# EAGLE design SDW BLUEPILL (EAGLE 9.6.2)
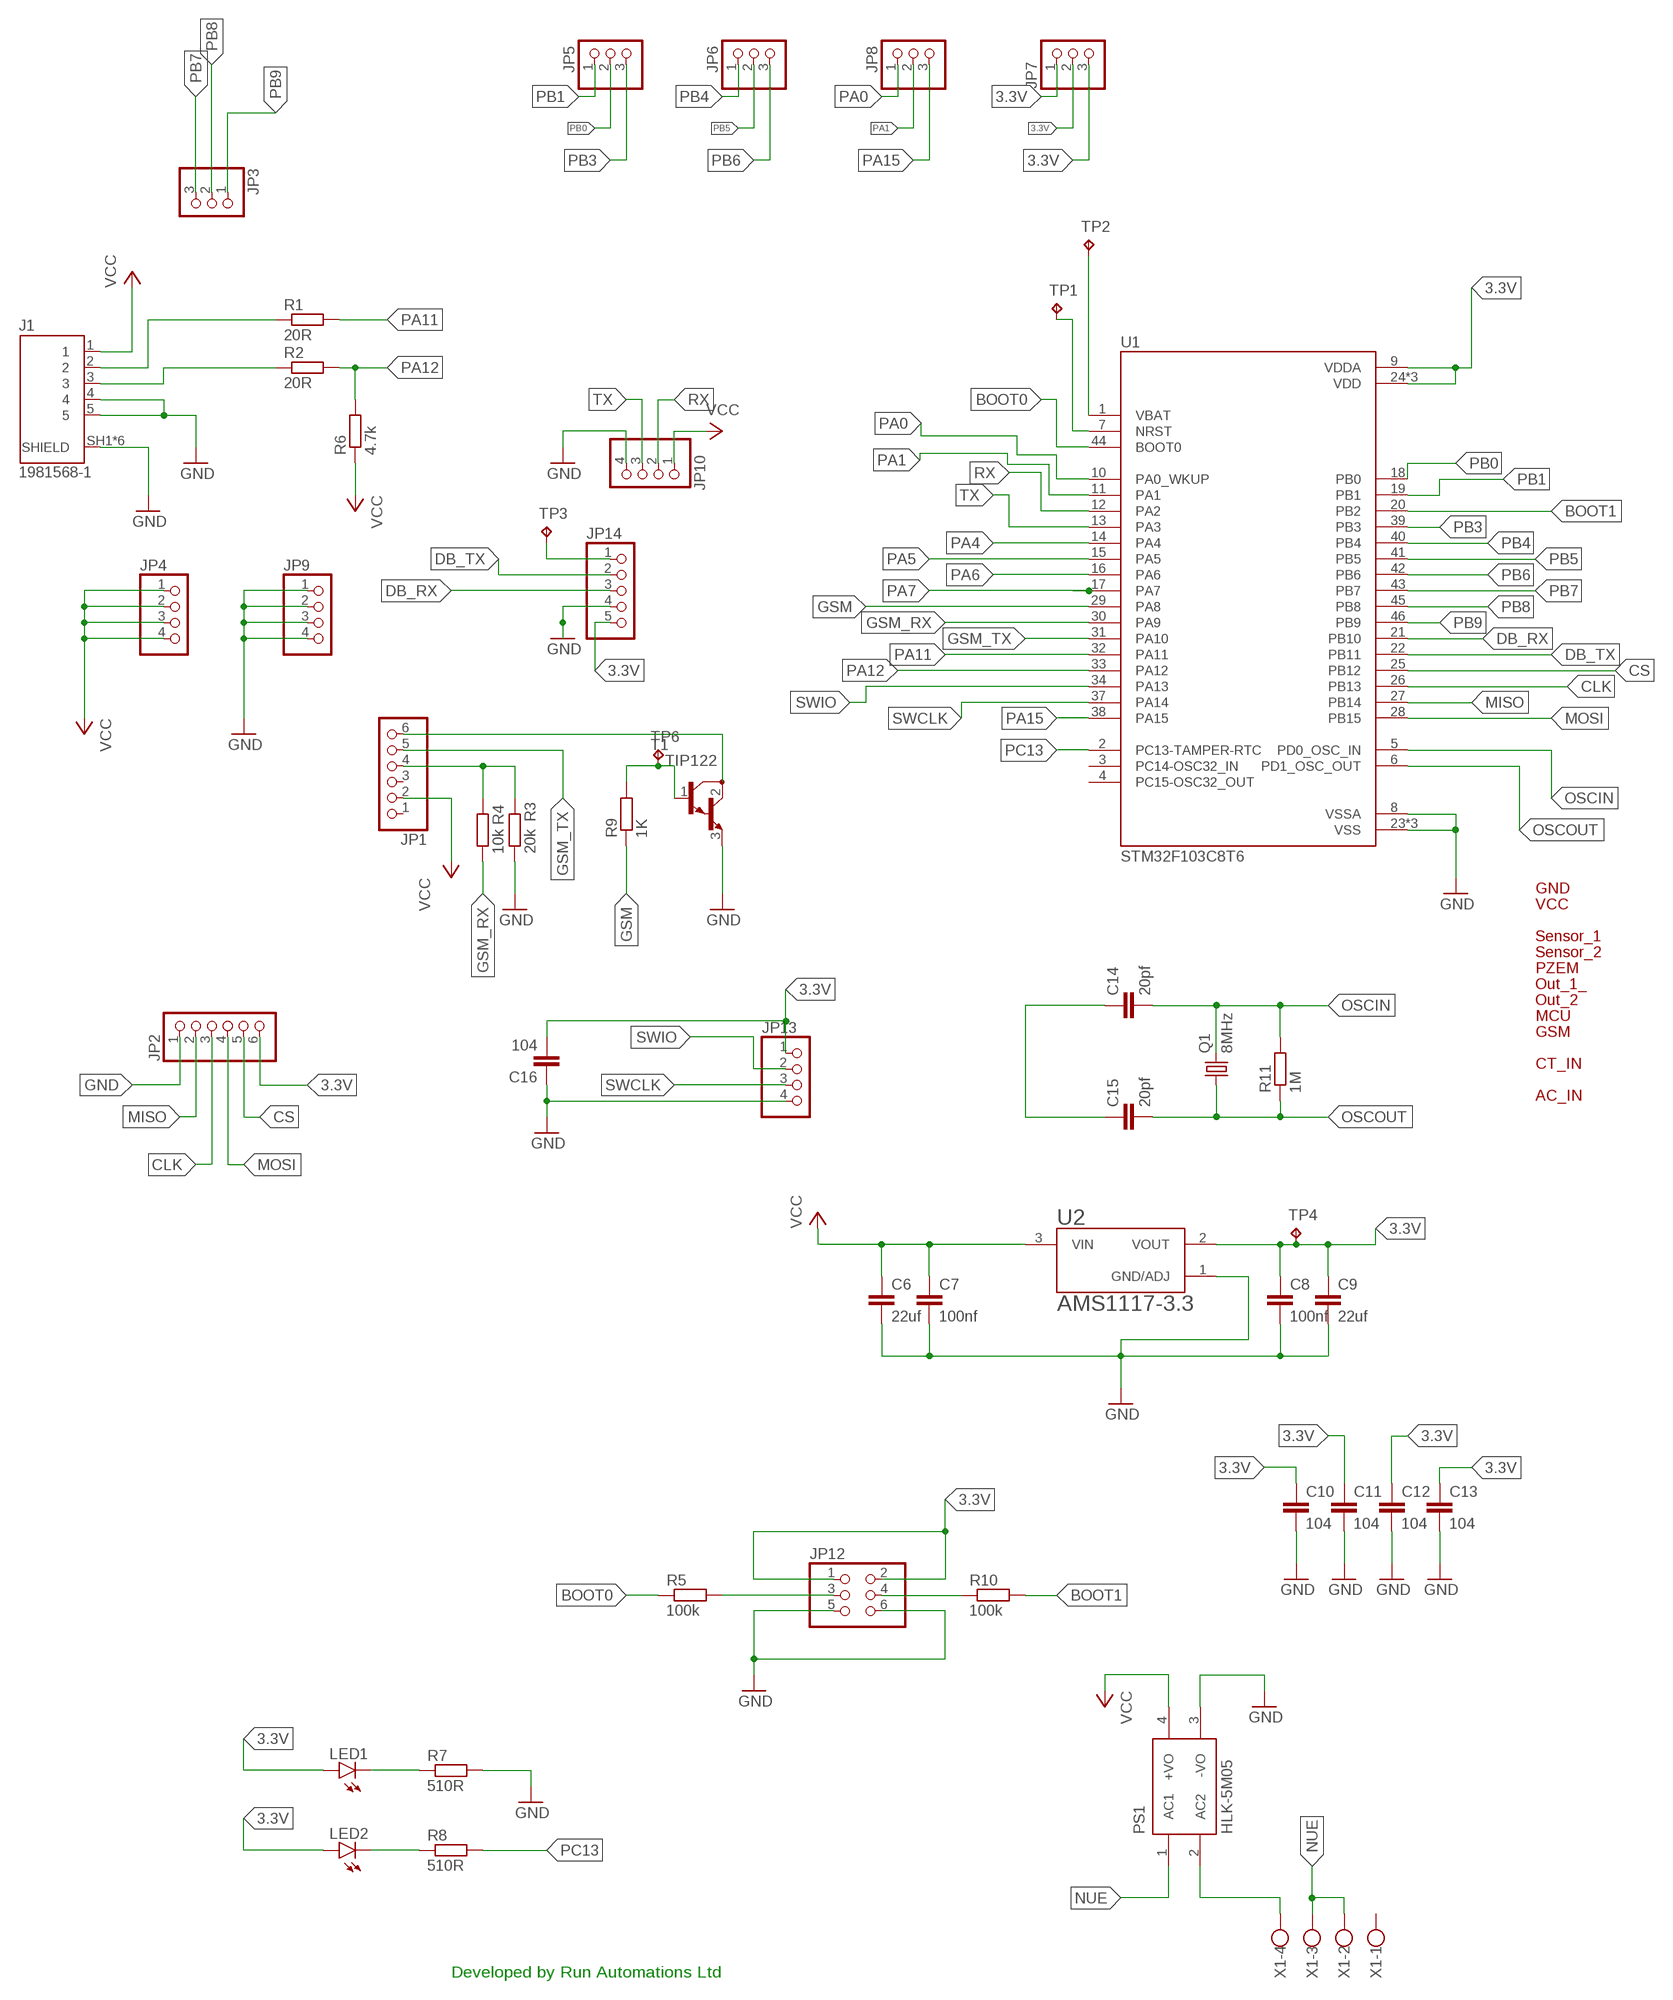
[diagram p0: schematic, sheet 1]

## Parts
C6  22uf  C-EUC0805  [C0805]
C7  100nf  C-EUC0805  [C0805]
C8  100nf  C-EUC0805  [C0805]
C9  22uf  C-EUC0805  [C0805]
C10  104  C-EUC0805  [C0805]
C11  104  C-EUC0805  [C0805]
C12  104  C-EUC0805  [C0805]
C13  104  C-EUC0805  [C0805]
C14  20pf  C-EUC0805  [C0805]
C15  20pf  C-EUC0805  [C0805]
C16  104  C-EUC0805  [C0805]
J1  1981568-1  [TE_1981568-1]
JP1  PINHD-1X6  [1X06]
JP2  PINHD-1X6  [1X06]
JP3  PINHD-1X3  [1X03]
JP4  PINHD-1X4  [1X04]
JP5  PINHD-1X3  [1X03]
JP6  PINHD-1X3  [1X03]
JP7  PINHD-1X3  [1X03]
JP8  PINHD-1X3  [1X03]
JP9  PINHD-1X4  [1X04]
JP10  PINHD-1X4  [1X04]
JP12  PINHD-2X3  [2X03]
JP13  PINHD-1X4/90  [1X04/90]
JP14  PINHD-1X5  [1X05]
LED1  LEDCHIPLED_0805  [CHIPLED_0805]
LED2  LEDCHIPLED_0805  [CHIPLED_0805]
PS1  HLK-5M05  [CONV_HLK-5M05]
Q1  8MHz  CRYSTALHC49S  [HC49/S]
R1  20R  R-EU_M0805  [M0805]
R2  20R  R-EU_M0805  [M0805]
R3  20k  R-EU_M0805  [M0805]
R4  10k  R-EU_M0805  [M0805]
R5  100k  R-EU_M0805  [M0805]
R6  4.7k  R-EU_M0805  [M0805]
R7  510R  R-EU_M0805  [M0805]
R8  510R  R-EU_M0805  [M0805]
R9  1K  R-EU_M0805  [M0805]
R10  100k  R-EU_M0805  [M0805]
R11  1M  R-EU_M0805  [M0805]
T1  TIP122  [TO220]
TP1  TPB1,27  [B1,27]
TP2  TPB1,27  [B1,27]
TP3  TPB1,27  [B1,27]
TP4  TPB1,27  [B1,27]
TP6  TPB1,27  [B1,27]
U1  STM32F103C8T6  [QFP50P900X900X160-48N]
U2  AMS1117-3.3  [SOT229P700X180-4N]
U$2  VCC0  [VCC0]
U$3  GND0  [GND0]
U$5  SENSOR_10  [SENSOR_10]
U$6  SENSOR_20  [SENSOR_20]
U$7  PZEM0  [PZEM0]
U$8  OUT_1_0  [OUT_1_0]
U$9  OUT_20  [OUT_20]
U$10  MCU0  [MCU0]
U$11  GSM0  [GSM0]
U$13  CT_IN0  [CT_IN0]
U$15  AC_IN0  [AC_IN0]
X1  W237-4  [W237-4]

## Nets
3.3V: C8.1 C9.1 C10.1 C11.1 C12.1 C13.1 C16.2 JP2.6 JP7.1 JP7.2 JP7.3 JP12.1 JP12.2 JP13.1 JP14.5 LED1.A LED2.A TP4.TP U1.9(VDDA) U1.24(VDD) U1.36(VDD) U1.48(VDD) U2.2(VOUT)
BOOT0: R5.1 U1.44(BOOT0)
BOOT1: R10.2 U1.20(PB2)
CLK: JP2.3 U1.26(PB13)
CS: JP2.5 U1.25(PB12)
DB_RX: JP14.3 U1.21(PB10)
DB_TX: JP14.2 U1.22(PB11)
GND: C6.2 C7.2 C8.2 C9.2 C10.2 C11.2 C12.2 C13.2 C16.1 J1.4 J1.5 J1.SH1(SHIELD) J1.SH2(SHIELD) J1.SH3(SHIELD) J1.SH4(SHIELD) J1.SH5(SHIELD) J1.SH6(SHIELD) JP2.1 JP9.1 JP9.2 JP9.3 JP9.4 JP10.4 JP12.5 JP12.6 JP13.4 JP14.4 PS1.3(-VO) R3.1 R7.2 T1.3(E) U1.8(VSSA) U1.23(VSS) U1.35(VSS) U1.47(VSS) U2.1(GND/ADJ)
GSM: R9.1 U1.29(PA8)
GSM_RX: R4.1 U1.30(PA9)
GSM_TX: JP1.5 U1.31(PA10)
MISO: JP2.2 U1.27(PB14)
MOSI: JP2.4 U1.28(PB15)
N$1: PS1.2(AC2) X1.4
N$2: J1.2 R1.1
N$3: JP1.6 T1.2(C)
N$4: JP1.4 R3.2 R4.2
N$5: R9.2 T1.1(B) TP6.TP
N$6: LED1.C R7.1
N$8: J1.3 R2.1
N$9: LED2.C R8.1
N$10: JP12.3 R5.2
N$11: JP12.4 R10.1
N$16: C14.1 C15.1
N$18: TP2.TP U1.1(VBAT)
N$19: TP1.TP U1.7(NRST)
N$20: JP14.1 TP3.TP
NUE: PS1.1(AC1) X1.2 X1.3
OSCIN: C14.2 Q1.2 R11.2 U1.5(PD0_OSC_IN)
OSCOUT: C15.2 Q1.1 R11.1 U1.6(PD1_OSC_OUT)
PA0: JP8.1 U1.10(PA0_WKUP)
PA1: JP8.2 U1.11(PA1)
PA4: U1.14(PA4)
PA5: U1.15(PA5)
PA6: U1.16(PA6)
PA7: U1.17(PA7)
PA11: R1.2 U1.32(PA11)
PA12: R2.2 R6.2 U1.33(PA12)
PA15: JP8.3 U1.38(PA15)
PB0: JP5.2 U1.18(PB0)
PB1: JP5.1 U1.19(PB1)
PB3: JP5.3 U1.39(PB3)
PB4: JP6.1 U1.40(PB4)
PB5: JP6.2 U1.41(PB5)
PB6: JP6.3 U1.42(PB6)
PB7: JP3.3 U1.43(PB7)
PB8: JP3.2 U1.45(PB8)
PB9: JP3.1 U1.46(PB9)
PC13: R8.2 U1.2(PC13-TAMPER-RTC)
RX: JP10.2 U1.12(PA2)
SWCLK: JP13.3 U1.37(PA14)
SWIO: JP13.2 U1.34(PA13)
TX: JP10.3 U1.13(PA3)
VCC: C6.1 C7.1 J1.1 JP1.2 JP4.1 JP4.2 JP4.3 JP4.4 JP10.1 PS1.4(+VO) R6.1 U2.3(VIN)
Unconnected: JP1.1 JP1.3 U1.3(PC14-OSC32_IN) U1.4(PC15-OSC32_OUT) X1.1

## Notes on the sheet
- Developed by Run Automations Ltd

## Library data of the parts
C6-C16 = rcl:C-EU: CAPACITOR, European symbol; SPICEPREFIX: C
J1 = 1981568-1:1981568-1: Check availability <https://pricing.snapeda.com/parts/1981568-1/TE%20Connectivity/view-part?ref=eda>; AVAILABILITY: In Stock; CHECK_PRICES: https://www.snapeda.com/parts/1981568-1/TE+Connectivity+AMP+Connectors/view-part/?ref=eda; COMMENT: 1981568-1; DESCRIPTION: MICRO USB, TYPE B,; MF: TE Connectivity; MP: 1981568-1; PACKAGE: None; PRICE: None; PURCHASE-URL: https://www.snapeda.com/api/url_track_click_mouser/?unipart_id=99860&manufacturer=TE Connectivity&part_name=1981568-1&search_term=usb micro; SNAPEDA_LINK: https://www.snapeda.com/parts/1981568-1/TE+Connectivity+AMP+Connectors/view-part/?ref=snap
JP1 JP2 = pinhead:PINHD-1X6: PIN HEADER
JP3 JP5-JP8 = pinhead:PINHD-1X3: PIN HEADER
JP4 JP9 JP10 JP13 = pinhead:PINHD-1X4: PIN HEADER
JP12 = pinhead:PINHD-2X3: PIN HEADER
JP14 = pinhead:PINHD-1X5: PIN HEADER
LED1 LED2 = led:LED: LED OSRAM: - CHIPLED LG R971, LG N971, LY N971, LG Q971, LY Q971, LO R971, LY R971 LH N974, LH R974 LS Q976, LO Q976, LY Q976 LO Q996 - Hyper CHIPLED LW Q18S LB Q993, LB Q99A, LB R99A - SideLED LS A670, LO A670, LY A670, LG A670, LP A670 LB A673, LV A673, LT A673, LW A673 LH A674 LY A675 LS A676, LA A676, LO A676, LY A676, LW A676 LS A679, LY A679, LG A679 - Hyper Micro SIDELED® LS Y876, LA Y876, LO Y876, LY Y876 LT Y87S - SmartLED LW L88C, LW L88S LB L89C, LB L89S, LG L890 LS L89K, LO L89K, LY L89K LS L896, LA L896, LO L896, LY L896 - TOPLED LS T670, LO T670, LY T670, LG T670, LP T670 LSG T670, LSP T670, LSY T670, LOP T670, LYG T670 LG T671, LOG T671, LSG T671 LB T673, LV T673, LT T673, LW T673 LH T674 LS T676, LA T676, LO T676, LY T676, LB T676, LH T676, LSB T676, LW T676 LB T67C, LV T67C, LT T67C, LS T67K, LO T67K, LY T67K, LW E67C LS E67B, LA E67B, LO E67B, LY E67B, LB E67C, LV E67C, LT E67C LW T67C LS T679, LY T679, LG T679 LS T770, LO T770, LY T770, LG T770, LP T770 LB T773, LV T773, LT T773, LW T773 LH T774 LS E675, LA E675, LY E675, LS T675 LS T776, LA T776, LO T776, LY T776, LB T776 LHGB T686 LT T68C, LB T68C - Hyper Mini TOPLED® LB M676 - Mini TOPLED Santana® LG M470 LS M47K, LO M47K, LY M47K Source: http://www.osram.convergy.de LUXEON: - LUMILED® LXK2-PW12-R00, LXK2-PW12-S00, LXK2-PW14-U00, LXK2-PW14-V00 LXK2-PM12-R00, LXK2-PM12-S00, LXK2-PM14-U00 LXK2-PE12-Q00, LXK2-PE12-R00, LXK2-PE12-S00, LXK2-PE14-T00, LXK2-PE14-U00 LXK2-PB12-K00, LXK2-PB12-L00, LXK2-PB12-M00, LXK2-PB14-N00, LXK2-PB14-P00, LXK2-PB14-Q00 LXK2-PR12-L00, LXK2-PR12-M00, LXK2-PR14-Q00, LXK2-PR14-R00 LXK2-PD12-Q00, LXK2-PD12-R00, LXK2-PD12-S00 LXK2-PH12-R00, LXK2-PH12-S00 LXK2-PL12-P00, LXK2-PL12-Q00, LXK2-PL12-R00 Source: www.luxeon.com KINGBRIGHT: KA-3528ASYC Source: www.kingbright.com
PS1 = HLK-5M05:HLK-5M05: AC DC 220V to 5V 5W 5Watt Isolated Switching Step-Down Power Supply Module Converter Check availability <https://pricing.snapeda.com/parts/HLK-5M05/Hi-link/view-part?ref=eda>; AVAILABILITY: Not in stock; CHECK_PRICES: https://www.snapeda.com/parts/HLK-5M05/Hi-link/view-part/?ref=eda; MF: Hi-link; MP: HLK-5M05; PACKAGE: Package; PRICE: None; SNAPEDA_LINK: https://www.snapeda.com/parts/HLK-5M05/Hi-link/view-part/?ref=snap
Q1 = crystal:CRYSTAL: CRYSTAL; OC_FARNELL: 1667008; OC_NEWARK: unknown
R1-R11 = rcl:R-EU_: RESISTOR, European symbol; SPICEPREFIX: R
T1 = TIP122:TIP122: NPN BIPOLAR DARLINGTON TRANSISTOR Check availability <https://pricing.snapeda.com/parts/TIP122/STMicroelectronics/view-part?ref=eda>; AVAILABILITY: In Stock; CHECK_PRICES: https://www.snapeda.com/parts/TIP122/STMicroelectronics/view-part/?ref=eda; DESCRIPTION: Bipolar (BJT) Transistor NPN - Darlington 100 V 5 A - 2 W Through Hole TO-220FP; MF: STMicroelectronics; MP: TIP122; PACKAGE: TO-220 STMicroelectronics; PRICE: None; SNAPEDA_LINK: https://www.snapeda.com/parts/TIP122/STMicroelectronics/view-part/?ref=snap
TP1-TP4 TP6 = testpad:TP: Test pad
U1 = STM32F103C8T6:STM32F103C8T6: Check availability <https://pricing.snapeda.com/parts/STM32F103C8T6/STMicroelectronics/view-part?ref=eda>; AVAILABILITY: In Stock; CHECK_PRICES: https://www.snapeda.com/parts/STM32F103C8T6/STMicroelectronics/view-part/?ref=eda; DESCRIPTION: ARM® Cortex®-M3 STM32F1 Microcontroller IC 32-Bit 72MHz 64KB (64K x 8) FLASH 48-LQFP (7x7); MF: STMicroelectronics; MP: STM32F103C8T6; PACKAGE: LQFP-48 STMicroelectronics; PRICE: None; PURCHASE-URL: https://www.snapeda.com/api/url_track_click_mouser/?unipart_id=52195&manufacturer=STMicroelectronics&part_name=STM32F103C8T6&search_term=None; SNAPEDA_LINK: https://www.snapeda.com/parts/STM32F103C8T6/STMicroelectronics/view-part/?ref=snap
U2 = AMS1117-3.3:AMS1117-3.3: Check availability <https://pricing.snapeda.com/parts/AMS1117-3.3/Advanced%20Monolithic%20Systems/view-part?ref=eda>; AVAILABILITY: Not in stock; CHECK_PRICES: https://www.snapeda.com/parts/AMS1117-3.3/Advanced+Monolithic+Systems/view-part/?ref=eda; DESCRIPTION: Sot223/Pkg 1-Amp 3.3-Volt Low Drop Out Voltage Regulatator; MF: Advanced Monolithic Systems; MP: AMS1117-3.3; PACKAGE: SOT-223 Seeed Technology; PRICE: None; SNAPEDA_LINK: https://www.snapeda.com/parts/AMS1117-3.3/Advanced+Monolithic+Systems/view-part/?ref=snap
U$2 = VCC_labels:VCC0
U$3 = GND1_labels:GND0
U$5 = sensor 1_labels:SENSOR_10
U$6 = sensor 2_labels:SENSOR_20
U$7 = PZEM_labels:PZEM0
U$8 = out 1_labels:OUT_1_0
U$9 = out2_labels:OUT_20
U$10 = MCU_labels:MCU0
U$11 = GSM_labels:GSM0
U$13 = CT IN_labels:CT_IN0
U$15 = AC IN_labels:AC_IN0
X1 = con-wago-500:W237-4: WAGO SCREW CLAMP; OC_FARNELL: unknown; OC_NEWARK: unknown

## Board
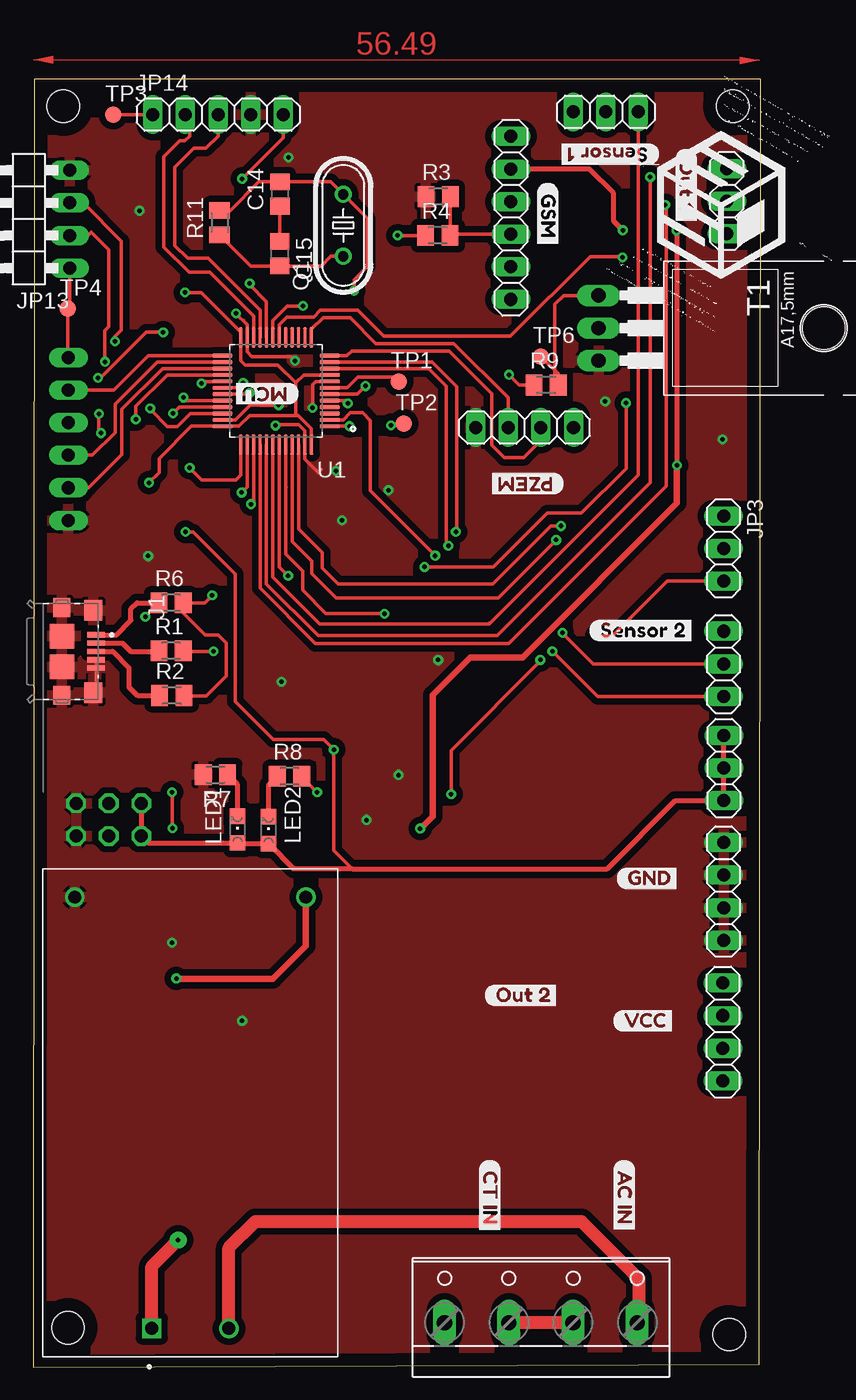
[diagram p1: board, top side]
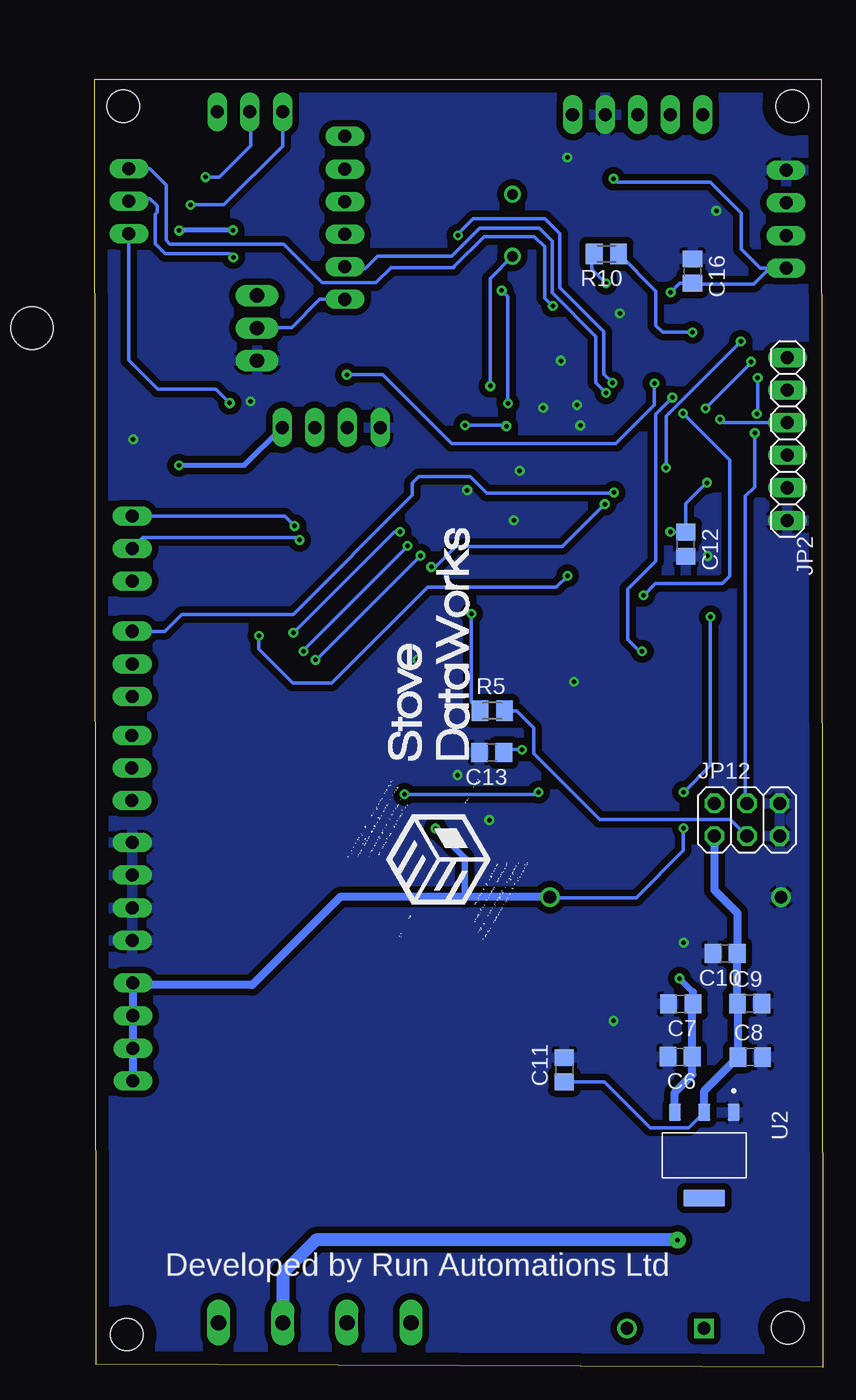
[diagram p2: board, bottom side, seen from below]

Size 56.69 x 100.38 mm. Coordinates in mm from the lower left corner, seen from the top.
Outline: 0,0 56.56,0.25 56.69,100.38 0.1,100.36 0,0
Copper layers (1*16): Top 0.035mm / dielectric 1.5mm / Bottom 0.035mm
Design rules "default": minimum track width 6mil, minimum drill 0.35mm, track to track 6mil, track to pad 6mil, pad to pad 6mil, via to via 6mil, smd to smd 6mil, copper to edge 40mil, drill to drill 6mil, minimum pad ring 10mil, minimum via ring 8mil, stop-mask expansion 4mil, vias tented up to drill 0mil, thermal gap 10mil
Holes 2.54 mm at 54.2,2.57 54.48,98.27 2.72,3.1 2.36,98.25

### Footprints (pad centres in the part's own frame; a part is rotated, then mirrored left to right if it is on the bottom)
C0805 = smd 1.3 x 1.5: 1 -0.95,0; 2 0.95,0
TE_1981568-1 = smd 0.4 x 1.35: 1 -1.3,2.675; 2 -0.65,2.675; 3 0,2.675; 4 0.65,2.675; 5 1.3,2.675 | smd 1.6 x 1.4: SH1 -3.2,2.45; SH2 3.2,2.45 | smd 1.45 x 1.3: SH3 3.425,0; SH6 -3.425,0 | smd 1.9 x 1.9: SH4 1.2,0; SH5 -1.2,0
1X06 = drill 1.016 long: 1 -6.35,0; 2 -3.81,0; 3 -1.27,0; 4 1.27,0; 5 3.81,0; 6 6.35,0
1X03 = drill 1.016 long: 1 -2.54,0; 2 0,0; 3 2.54,0
1X04 = drill 1.016 long: 1 -3.81,0; 2 -1.27,0; 3 1.27,0; 4 3.81,0
2X03 = drill 1.016 octagon: 1 -2.54,-1.27; 2 -2.54,1.27; 3 0,-1.27; 4 0,1.27; 5 2.54,-1.27; 6 2.54,1.27
1X04/90 = drill 1.016 long: 1 -3.81,-3.81; 2 -1.27,-3.81; 3 1.27,-3.81; 4 3.81,-3.81
1X05 = drill 1.016 long: 1 -5.08,0; 2 -2.54,0; 3 0,0; 4 2.54,0; 5 5.08,0
CHIPLED_0805 = smd 1.2 x 1.2: A 0,-1.05; C 0,1.05
CONV_HLK-5M05 = drill 1 pad 1.5 square: 1 -16.8,3 | drill 1 pad 1.5: 2 -16.8,-3; 3 16.8,9; 4 16.8,-9
HC49/S = drill 0.813: 1 -2.413,0; 2 2.413,0
M0805 = smd 1.3 x 1.6: 1 -0.95,0; 2 0.95,0
TO220 = drill 1.118 long: 1 -2.54,-6.35; 2 0,-6.35; 3 2.54,-6.35 | hole 3.302: 0,11.176
B1,27 = smd 1.27 x 1.27: TP 0,0
QFP50P900X900X160-48N = smd 1.56 x 0.28: 1 -4.18,2.75; 2 -4.18,2.25; 3 -4.18,1.75; 4 -4.18,1.25; 5 -4.18,0.75; 6 -4.18,0.25; 7 -4.18,-0.25; 8 -4.18,-0.75; 9 -4.18,-1.25; 10 -4.18,-1.75; 11 -4.18,-2.25; 12 -4.18,-2.75; 25 4.18,-2.75; 26 4.18,-2.25; 27 4.18,-1.75; 28 4.18,-1.25; 29 4.18,-0.75; 30 4.18,-0.25; 31 4.18,0.25; 32 4.18,0.75; 33 4.18,1.25; 34 4.18,1.75; 35 4.18,2.25; 36 4.18,2.75 | smd 0.28 x 1.56: 13 -2.75,-4.18; 14 -2.25,-4.18; 15 -1.75,-4.18; 16 -1.25,-4.18; 17 -0.75,-4.18; 18 -0.25,-4.18; 19 0.25,-4.18; 20 0.75,-4.18; 21 1.25,-4.18; 22 1.75,-4.18; 23 2.25,-4.18; 24 2.75,-4.18; 37 2.75,4.18; 38 2.25,4.18; 39 1.75,4.18; 40 1.25,4.18; 41 0.75,4.18; 42 0.25,4.18; 43 -0.25,4.18; 44 -0.75,4.18; 45 -1.25,4.18; 46 -1.75,4.18; 47 -2.25,4.18; 48 -2.75,4.18
SOT229P700X180-4N = smd 1.31 x 0.93: 1 -3.345,2.29; 2 -3.345,0; 3 -3.345,-2.29 | smd 1.31 x 3.24: 4 3.345,0
W237-4 = drill 1.194 long: 1 -7.5,-1.27; 2 -2.5,-1.27; 3 2.5,-1.27; 4 7.5,-1.27

### Placement (x,y rotation side)
C6  11.1,24.21 180 bottom
C7  11.05,28.32 180 bottom
C8  5.64,24.18 0 bottom
C9  5.69,28.35 0 bottom
C10  7.59,32.26 180 bottom
C11  20.12,23.19 90 bottom
C12  10.67,64.13 270 bottom
C13  25.78,47.9 180 bottom
C14  19.23,91.41 90 top
C15  19.2,86.77 270 top
C16  10.13,85.42 270 bottom
J1  2.24,55.78 270 top
JP1  37.21,89.56 270 top
JP2  2.74,72.34 90 bottom
JP3  53.77,63.8 270 top
JP4  53.72,26.14 90 top
JP5  54.03,90.86 270 top
JP6  44.6,97.82 0 top
JP7  53.8,46.71 90 top
JP8  53.77,54.81 90 top
JP9  53.77,37.08 90 top
JP10  38.28,73.23 180 top
JP12  5.89,42.67 0 bottom
JP13  -0.97,89.46 90 top
JP14  14.4,97.61 0 top
LED1  15.93,41.91 0 top
LED2  18.34,41.86 0 top
PS1  12.24,19.84 90 top
Q1  24.16,88.98 90 top
R1  10.74,55.83 0 top
R2  10.8,52.35 0 top
R3  31.55,91.21 0 top
R4  31.52,88.19 0 top
R5  25.73,51.16 0 bottom
R6  10.74,59.56 0 top
R7  14.2,46.18 180 top
R8  19.96,46.05 0 top
R9  39.95,76.53 0 top
R10  16.84,86.77 180 bottom
R11  14.53,89.18 90 top
T1  50.39,80.98 270 top
TP1  28.47,76.81 0 top
TP2  28.85,73.53 0 top
TP3  6.25,97.59 0 top
TP4  2.69,82.47 0 top
TP6  39.55,78.77 0 top
U1  18.92,76.07 180 top
U2  9.22,16.54 270 bottom
U$2  45.08,27 0 top
U$3  45.36,38.1 0 top
U$5  48.79,94.54 180 top
U$6  43.28,57.4 0 top
U$7  41.43,68.86 180 top
U$8  50.85,95.02 270 top
U$9  35.1,28.98 0 top
U$10  20.73,75.87 180 top
U$11  40.08,92.33 270 top
U$13  35.56,16.26 270 top
U$15  46.02,16.23 270 top
X1  39.55,4.75 0 top

### Tracks (layer width: path | path; a pad name or v marks a point on that pad's centre or on a via)
3.3V  (via drill 0.35)
  Top 0.254: v9.02,68.94 9.8,69.72 9.8,70.82 12.31,73.32 U1.36 16.02,73.32 16.87,74.17 20.45,74.17 | 20.45,74.17 20.65,74.17 21.67,73.15 U1.48 | 20.45,74.17 20.45,76.71 | U1.9 21.06,77.32 20.45,76.71 | 20.45,76.71 19.05,78.11 16.51,78.11 16.17,78.44 U1.24 16.17,80.68 13.11,83.74 v11.84,83.74 | JP13.1 2.84,82.63 TP4.TP 2.69,78.74 JP2.6 | v11.86,65.1 12.47,65.1 15.75,61.82 15.75,51.87 18.69,48.92 22.63,48.92 v23.42,48.13 23.42,40.28 24.84,38.85 | JP14.5 19.48,95.81 v16.28,92.61
  Top 0.406: JP12.2 JP12.1 8.97,40.86 LED1.A 15.98,40.81 LED2.A 20.29,38.85 24.84,38.85 44.7,38.85 50.01,44.17 JP7.1 JP7.2 JP7.3
  Bottom 0.254: v11.84,83.74 11.11,84.47 C16.2 10.07,84.4 5.36,84.4 4.11,85.65 | JP13.1 4.11,85.65 | 4.11,85.65 4.88,85.65 6.35,87.12 6.35,89.92 8.76,92.33 16,92.33 v16.28,92.61 | v9.02,68.94 10.67,67.28 C12.1 11.82,65.09 11.84,65.1 v11.86,65.1 | U2.2 10.43,18.67 13.44,18.67 17.01,22.24 C11.1 | v23.42,48.13 24.6,48.13 C13.1
  Bottom 0.61: U2.2 9.22,21.55 C8.1 6.59,28.3 C9.1 C10.1 6.64,35.4 8.43,37.19 JP12.1
BOOT0  (via drill 0.35)
  Top 0.254: v27.36,58.72 22.81,58.72 20.98,60.55 20.98,62.05 19.67,63.36 19.67,68.64 | U1.44 19.67,68.64 | 19.67,68.64 19.71,68.61
  Bottom 0.254: R5.1 27.36,51.83 v27.36,58.72
BOOT1  (via drill 0.35)
  Top 0.254: U1.20 18.17,83.05 16.87,84.35 v16.87,84.46
  Bottom 0.254: v16.87,84.46 17.98,85.57 17.98,86.57 R10.2
CLK
  Top 0.254: U1.26 9.67,78.32 6.4,75.06 6.4,72.85 4.62,71.07 JP2.3
CS
  Top 0.254: U1.25 8.97,78.82 6.3,76.15 JP2.5
DB_RX
  Top 0.254: U1.21 17.67,82.38 13.64,86.41 12.04,86.41 11.05,87.4 11.05,93.5 12.52,94.97 13.46,94.97 14.4,95.91 JP14.3
DB_TX
  Top 0.254: U1.22 17.17,81.89 13.74,85.32 12.14,85.32 10.19,87.27 10.19,94.31 11.43,95.55 11.81,95.55 12.19,95.94 12.19,97.28 JP14.2
GND  (via drill 0.35)
  Top 0.254: U1.35 15.76,73.82 16.92,74.98 v19.13,74.98 | v20.4,78.44 20.07,78.77 17.04,78.77 16.67,79.14 U1.23 16.67,81.24 v15.8,82.12 | U1.8 22.01,76.82 21.77,76.58 v21.77,74.75 | v18.87,73.38 18.95,73.46 20.7,73.46 21.17,72.98 U1.47 21.17,70.78 22.23,69.72 22.45,69.95 | J1.4 J1.5 4.91,52.8 J1.SH2
  other vias: 27.69,68.35 8.97,63.22 19.35,53.42 10.82,33.1 16.28,27 8.28,90.12 19.89,94.26 24.05,65.99 23.6,69.85 44.55,75.26 28.45,46.15 25.96,42.65 31.55,55.12 53.7,72.31
  pour Top (isolate 0.508): -1.32,100.79 57.43,100.79 57.43,-1.4 -1.32,-1.4
  pour Bottom (isolate 0.508): -2.59,-1.4 58.52,-1.4 58.52,102.74 -2.59,102.74
GSM  (via drill 0.35)
  Top 0.254: U1.29 13.12,76.82 13.11,76.84 v13.11,76.67 | R9.1 37.87,76.53 v37.06,77.34
  Bottom 0.254: v13.11,76.67 13.11,74.98 16.13,71.96 28.88,71.96 34.26,77.34 v37.06,77.34
GSM_RX  (via drill 0.35)
  Top 0.254: U1.30 15.97,76.32 v16.36,76.71 | v28.4,88.19 R4.1
  Bottom 0.254: v16.36,76.71 17.04,77.39 17.04,80.7 20.47,84.12 20.47,88.34 21.64,89.51 27.23,89.51 28.4,88.34 v28.4,88.19
GSM_TX  (via drill 0.35)
  Top 0.254: U1.31 16.77,75.82 v16.87,75.92
  Bottom 0.254: v16.87,75.92 17.65,76.71 17.65,80.31 21.06,83.72 21.06,87.73 22.07,88.75 26.72,88.75 28.88,86.59 34.65,86.59 35.61,85.62 37.08,85.62 JP1.5
MISO
  Top 0.254: U1.27 10.08,77.82 6.91,74.65 6.91,71.12 4.32,68.53 JP2.2
MOSI  (via drill 0.35)
  Top 0.254: U1.28 10.44,77.32 8,74.88 v8,73.86
  Bottom 0.254: v8,73.86 7.75,73.61 JP2.4
N$1
  Top 1.016: X1.4 47.17,3.36 47.17,6.9 42.7,11.38 17.32,11.38 15.24,9.3 PS1.2
N$2
  Top 0.406: J1.2 6.94,56.43 7.59,55.78 9.74,55.78 R1.1
N$3
  Bottom 0.254: JP1.6 39.17,83.21 41.35,81.03 43.99,81.03 T1.2
N$4
  Top 0.254: R3.2 32.47,91.19 R4.2 32.57,88.29 JP1.4
N$5
  Top 0.254: 39.56,78.76 TP6.TP 40.9,77.41 R9.2 | 40.89,76.54 R9.2 | R9.2 41.15,76.53 40.64,77.04 40.64,82.83 41.33,83.52 T1.1
N$6
  Top 0.406: LED1.C 15.93,45.4 R7.1
N$8
  Top 0.406: J1.3 6.2,55.78 7.47,54.51 7.47,53.01 8.13,52.35 R2.1
N$9
  Top 0.406: LED2.C 18.34,45.37 R8.1
N$10
  Bottom 0.254: 24.68,51.05 R5.2 23.83,51.16 22.5,49.83 22.5,47.83 17.37,42.7 7.19,42.7 JP12.3
N$11  (via drill 0.35)
  Top 0.254: v10.13,80.65 8.81,80.65 5.21,77.04 5.08,77.04 5.05,77.06 v5.05,77.09 | v5.13,74.3 5.13,72.8 v5.28,72.8
  Bottom 0.254: R10.1 12.98,83.86 12.98,81.15 12.47,80.65 v10.13,80.65 | JP12.4 6.02,44.07 6.02,67.87 5.28,68.61 v5.28,72.8 | v5.05,77.09 5.05,74.37 v5.13,74.3
N$16
  Top 0.254: C15.1 19.2,90.44 C14.1
N$18  (via drill 0.35)
  Top 0.254: 28.64,73.32 TP2.TP 28.73,73.41 v27.86,73.41 | U1.1 v24.63,73.32 v24.64,73.33
  Bottom 0.254: v24.64,73.33 24.71,73.41 v27.86,73.41
N$19
  Top 0.254: U1.7 24.46,76.32 25.27,77.14 28.09,77.14 28.42,76.81 TP1.TP
N$20
  Top 0.254: JP14.1 6.27,97.61 TP3.TP
NUE  (via drill 0.35 pad 1.3)
  Top 1.016: X1.3 X1.2 | PS1.1 9.24,7.87 v11.3,9.93
  Bottom 1.016: v11.3,9.93 39.45,9.93 42.05,7.33 X1.3
OSCIN  (via drill 0.35)
  Top 0.254: R11.2 15.35,90.13 17.59,92.36 C14.2 23.18,92.36 Q1.2 26.01,89.54 26.01,85.75 24.99,84.73 v24.99,83.9 | U1.5 24.25,75.32 24.46,75.11 v24.51,75.11
  Bottom 0.254: v24.51,75.11 24.51,83.41 v24.99,83.9
OSCOUT  (via drill 0.35)
  Top 0.254: U1.6 25.25,75.82 v25.88,76.45 | R11.1 16.94,85.82 C15.2 22.44,85.82 23.19,86.56 Q1.1
  Bottom 0.254: v25.88,76.45 25.88,84.84 Q1.1
PA0  (via drill 0.35)
  Top 0.254: U1.10 30.81,77.82 32.18,76.45 32.18,64.16 v32.33,64.01 | v40.44,55.8 43.97,52.27 JP8.1
  Bottom 0.254: v32.33,64.01 32.33,63.96 40.44,55.85 v40.44,55.8
PA1  (via drill 0.35)
  Top 0.254: U1.11 31.07,78.32 32.99,76.4 32.99,65.18 v32.92,65.1 | JP8.2 43.64,54.81 v41.22,57.23
  Bottom 0.254: v41.22,57.23 33.35,65.1 v32.92,65.1
PA11  (via drill 0.35)
  Top 0.254: U1.32 11.95,75.32 v11.71,75.57 | v14.06,55.79 11.73,55.79 R1.2
  Bottom 0.254: v11.71,75.57 13,74.27 13,62.81 15.16,60.66 15.16,56.69 14.2,55.73 14.1,55.83 v14.06,55.79
PA12  (via drill 0.35)
  Top 0.254: U1.33 11.77,74.82 | 11.77,74.82 11.76,74.83 | 11.77,74.82 11.4,74.82 10.9,74.32 v10.88,74.33 | v13.94,60.15 13.36,59.56 R6.2 11.69,58.79 13.41,57.07 14.4,57.07 15.04,56.44 15.04,53.87 13.49,52.32 11.77,52.32 R2.2
  Bottom 0.254: v10.88,74.33 7.24,70.69 7.24,61.65 7.82,61.06 13.03,61.06 v13.94,60.15
PA15  (via drill 0.35)
  Top 0.254: U1.38 16.67,68.59 v16.24,68.16 16.21,68.12
  Bottom 0.254: v16.24,68.16 16.29,68.11 26.15,68.11 27.43,69.39 31.47,69.39 31.95,68.91 31.95,67.95 41.22,58.67 49.91,58.67 51.26,57.33 53.75,57.33 JP8.3
PB0  (via drill 0.35)
  Top 0.254: U1.18 19.17,81.25 19.76,81.84 21.84,81.84 22.38,82.37 25.27,82.37 27.31,80.34 37.18,80.34 43.38,86.54 45.85,86.54 v45.9,86.49
  Bottom 0.254: v45.9,86.49 46.18,86.77 51.21,86.77 51.99,87.55 51.99,89.84 51.84,89.99 51.84,90.5 52.4,91.06 53.82,91.06 JP5.2
PB1  (via drill 0.35)
  Top 0.254: U1.19 18.67,81.56 19.79,82.68 21,82.68 v21.01,82.69
  Bottom 0.254: v21.01,82.69 21.64,83.32 21.64,87.3 22.45,88.11 26.37,88.11 28.68,85.8 28.68,85.75 28.73,85.7 33.6,85.7 34.8,84.51 38.96,84.51 41.99,87.53 50.85,87.53 51.13,87.81 51.13,92.13 52.4,93.4 JP5.1
PB3  (via drill 0.35)
  Top 0.254: U1.39 17.17,67.47 v16.97,67.26 | v30.48,62.36 35.84,62.36 40.03,66.55 42.7,66.55 46.18,70.03 v46.18,75.13
  Bottom 0.254: v16.97,67.26 20.27,63.96 28.58,63.96 30.18,62.36 v30.48,62.36 | v46.18,75.13 47.27,76.23 51.77,76.23 54.03,78.49 JP5.3
PB4  (via drill 0.35)
  Top 0.254: U1.40 17.67,60.71 21.97,56.41 37.03,56.41 49.3,68.68 49.3,90.5 v49.23,90.58
  Bottom 0.254: v49.23,90.58 46.63,90.58 42.06,95.15 JP6.1
PB5  (via drill 0.35)
  Top 0.254: U1.41 18.17,61.05 22.2,57.02 36.14,57.02 48.06,68.94 v48.06,92.74
  Bottom 0.254: v48.06,92.74 46.99,92.74 44.53,95.2 44.53,97.74 JP6.2
PB6
  Top 0.254: U1.42 18.67,61.57 22.33,57.91 35.53,57.91 | 35.53,57.99 35.53,57.91 | 35.53,57.91 47.14,69.52 JP6.3
PB7  (via drill 0.35)
  Top 0.254: U1.43 19.17,67.85 | 19.17,67.85 19.18,67.84 | 19.17,67.85 19.17,62.36 v19.86,61.67 | JP3.3 49.38,61.26 45.11,57 v43.89,57
  Bottom 0.254: v19.86,61.67 20.75,60.78 30.76,60.78 38.23,53.31 41.28,53.31 43.92,55.96 43.92,56.97 v43.89,57
PB8  (via drill 0.35)
  Top 0.254: U1.45 20.17,64.36 21.72,62.81 21.72,61.85 23.62,59.94 36.22,59.94 v40.74,64.47
  Bottom 0.254: v40.74,64.47 40.92,64.64 52.93,64.64 JP3.2
PB9  (via drill 0.35)
  Top 0.254: U1.46 20.67,65.31 22.5,63.47 22.5,62.28 23.75,61.04 35.79,61.04 40.31,65.56 v41.12,65.56
  Bottom 0.254: v41.12,65.56 41.91,66.34 JP3.1
PC13  (via drill 0.35)
  Top 0.254: U1.2 24.17,73.82 24.71,74.37 25.65,74.37 26.26,73.76 26.26,68.3 v31.32,63.25 | v39.5,55.12 39.5,55.02 32.56,48.08 v32.56,44.65 | v22.12,44.81 20.91,46.01 R8.2
  Bottom 0.254: v31.32,63.25 39.45,55.12 v39.5,55.12 | v32.56,44.65 22.28,44.65 v22.12,44.81
RX
  Top 0.254: JP10.2 39.55,72.21 38.23,70.89 36.7,70.89 35.74,71.86 35.74,75.87 32.41,79.2 24.82,79.2 24.44,78.82 U1.12
SWCLK  (via drill 0.35)
  Top 0.254: U1.37 16.17,69.54 15.77,69.14 13.13,69.14 v12.19,70.08 | JP13.3 3.89,90.73 6.86,87.76 6.86,80.8 6.32,80.26 6.32,79.93 v6.38,79.93
  Bottom 0.254: v6.38,79.93 12.19,74.12 v12.19,70.08
SWIO  (via drill 0.35)
  Top 0.254: U1.34 12.25,74.32 11.23,73.3 10.46,73.3 9.14,74.63 9.14,74.7 v9.12,74.73 | JP13.2 4.27,88.19 4.52,88.44 5.89,87.07 5.89,81.08 5.59,80.77 v5.59,78.36
  Bottom 0.254: v9.12,74.73 5.59,78.26 v5.59,78.36
TX
  Top 0.254: JP10.3 37.01,75.54 32.77,79.78 26.7,79.78 24.69,81.79 22.58,81.79 21.67,80.88 U1.13
VCC  (via drill 0.35)
  Top 0.254: R6.1 8.74,58.51 v8.74,58.47 | v10.82,44.81 10.82,42.04 v10.85,42.01
  Top 0.406: J1.1 6.51,57.08 7.62,58.19 7.62,59.11 8.08,59.56 R6.1 | 46.08,88.44 v45.92,88.6 45.21,89.31 45.21,91.47 43.31,93.37 JP1.2 | v50.11,88.57 50.11,70.28 v50.14,70.28
  Top 0.508: v50.14,70.28 50.14,67.34 38.13,55.32 34.04,55.32 31.12,52.4 31.12,42.93 30.18,41.99 v30.15,41.99 | PS1.4 21.24,32.83 18.67,30.25 11.15,30.25 v11.15,30.3
  Bottom 0.254: v8.74,58.47 8.74,46.89 v10.82,44.81 | v10.85,42.01 10.85,40.26 14.53,36.58 21.18,36.58 PS1.4
  Bottom 0.406: v45.92,88.6 50.09,88.6 v50.11,88.57 | JP10.1 45.03,70.28 v50.14,70.28
  Bottom 0.508: v30.15,41.99 27.86,39.7 27.86,36.64 | v11.15,30.3 10.1,29.25 10.1,29.23
  Bottom 0.61: U2.3 11.51,21.43 10.15,22.79 C6.1 10.15,28.27 C7.1 10.1,29.23 | PS1.4 27.86,36.64 37.58,36.64 44.42,29.79 53.57,29.79 JP4.4 JP4.3 JP4.2 JP4.1
(copper drawn outside any net)
  shapes: Top area x2

### Text on the board
Top: C:/Users/üþ/Desktop/ppt_run_logo-removebg-preview (1).bmp
tPlace: C:/Users/üþ/Desktop/833fa5b7-5833-432a-9f2a-6b4922d88c72.bmp | C:/Users/üþ/Desktop/ppt_run_logo-removebg-preview (1).bmp
bPlace: C:/Users/üþ/Desktop/dde252e6-fbb2-4a1c-8a70-5ada1f455f46.bmp | Developed by Run Automations Ltd
200bmp: C:/Users/üþ/Desktop/ppt_run_logo-removebg-preview (1).bmp